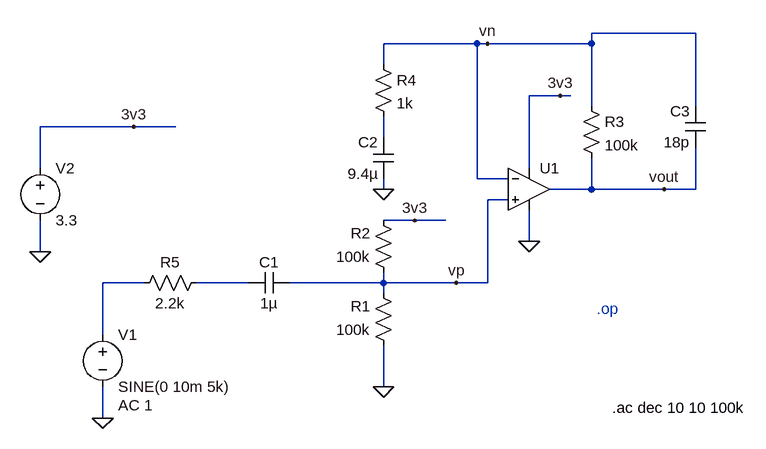
[diagram p0: schematic preamp.asc]
preamp.asc, the LTspice schematic file:
Version 4
SHEET 1 880 680
WIRE 448 -96 288 -96
WIRE 112 -80 -32 -80
WIRE 128 -80 112 -80
WIRE 288 -80 288 -96
WIRE 288 -80 128 -80
WIRE -32 -48 -32 -80
WIRE 240 0 192 0
WIRE 256 0 240 0
WIRE 288 16 288 -80
WIRE 448 16 448 -96
WIRE -416 48 -560 48
WIRE -352 48 -416 48
WIRE -32 64 -32 32
WIRE -560 112 -560 48
WIRE 192 112 192 0
WIRE 112 128 112 -80
WIRE 160 128 112 128
WIRE -32 144 -32 128
WIRE 288 144 288 96
WIRE 288 144 224 144
WIRE 400 144 288 144
WIRE 448 144 448 80
WIRE 448 144 400 144
WIRE 160 160 128 160
WIRE 16 192 -32 192
WIRE 64 192 16 192
WIRE 192 224 192 176
WIRE -560 240 -560 192
WIRE -400 288 -464 288
WIRE -240 288 -320 288
WIRE -32 288 -32 272
WIRE -32 288 -176 288
WIRE 80 288 -32 288
WIRE 128 288 128 160
WIRE 128 288 80 288
WIRE -32 304 -32 288
WIRE -464 368 -464 288
WIRE -32 448 -32 384
WIRE -464 496 -464 448
FLAG -32 448 0
FLAG -464 496 0
FLAG -560 240 0
FLAG 192 224 0
FLAG -32 144 0
FLAG -416 48 3v3
FLAG 240 0 3v3
FLAG 400 144 vout
FLAG 80 288 vp
FLAG 128 -80 vn
FLAG 16 192 3v3
SYMBOL Opamps\\UniversalOpamp2 192 144 R0
SYMATTR InstName U1
SYMATTR Value2 Avol=1.7Meg GBW=5.1Meg Slew=23Meg
SYMBOL res -16 400 R180
WINDOW 0 36 76 Left 2
WINDOW 3 36 40 Left 2
SYMATTR InstName R1
SYMATTR Value 100k
SYMBOL res -16 288 R180
WINDOW 0 36 76 Left 2
WINDOW 3 36 40 Left 2
SYMATTR InstName R2
SYMATTR Value 100k
SYMBOL cap -176 272 R90
WINDOW 0 0 32 VBottom 2
WINDOW 3 32 32 VTop 2
SYMATTR InstName C1
SYMATTR Value 1µ
SYMBOL voltage -464 352 R0
WINDOW 123 24 124 Left 2
WINDOW 39 0 0 Left 0
SYMATTR Value2 AC 1
SYMATTR InstName V1
SYMATTR Value SINE(0 10m 5k)
SYMBOL voltage -560 96 R0
WINDOW 123 0 0 Left 0
WINDOW 39 0 0 Left 0
SYMATTR InstName V2
SYMATTR Value 3.3
SYMBOL res 272 0 R0
SYMATTR InstName R3
SYMATTR Value 100k
SYMBOL res -48 -64 R0
SYMATTR InstName R4
SYMATTR Value 1k
SYMBOL cap -16 128 R180
WINDOW 0 24 56 Left 2
WINDOW 3 24 8 Left 2
SYMATTR InstName C2
SYMATTR Value 9.4µ
SYMBOL cap 464 80 R180
WINDOW 0 24 56 Left 2
WINDOW 3 24 8 Left 2
SYMATTR InstName C3
SYMATTR Value 18p
SYMBOL res -304 272 R90
WINDOW 0 0 56 VBottom 2
WINDOW 3 32 56 VTop 2
SYMATTR InstName R5
SYMATTR Value 2.2k
TEXT 320 480 Left 2 !.ac dec 10 10 100k
TEXT 296 328 Left 2 ;.op

The netlist it stands for:
* preamp.asc
XU1 vp vn 3v3 0 vout level.2 Avol=1.7Meg GBW=5.1Meg Slew=23Meg ilimit=25m rail=0 Vos=0 phimargin=45 en=0 enk=0 in=0 ink=0 Rin=500Meg  ; pins IN+ IN- V+ V- OUT
R1 0 vp 100k
R2 vp 3v3 100k
C1 vp N003 1µ
V1 N002 0 SINE(0 10m 5k) AC 1
V2 3v3 0 3.3
R3 vn vout 100k
R4 vn N001 1k
C2 0 N001 9.4µ
C3 vout vn 18p
R5 N003 N002 2.2k
.ac dec 10 10 100k
* .op
.lib UniversalOpamps2.sub
.backanno
.end